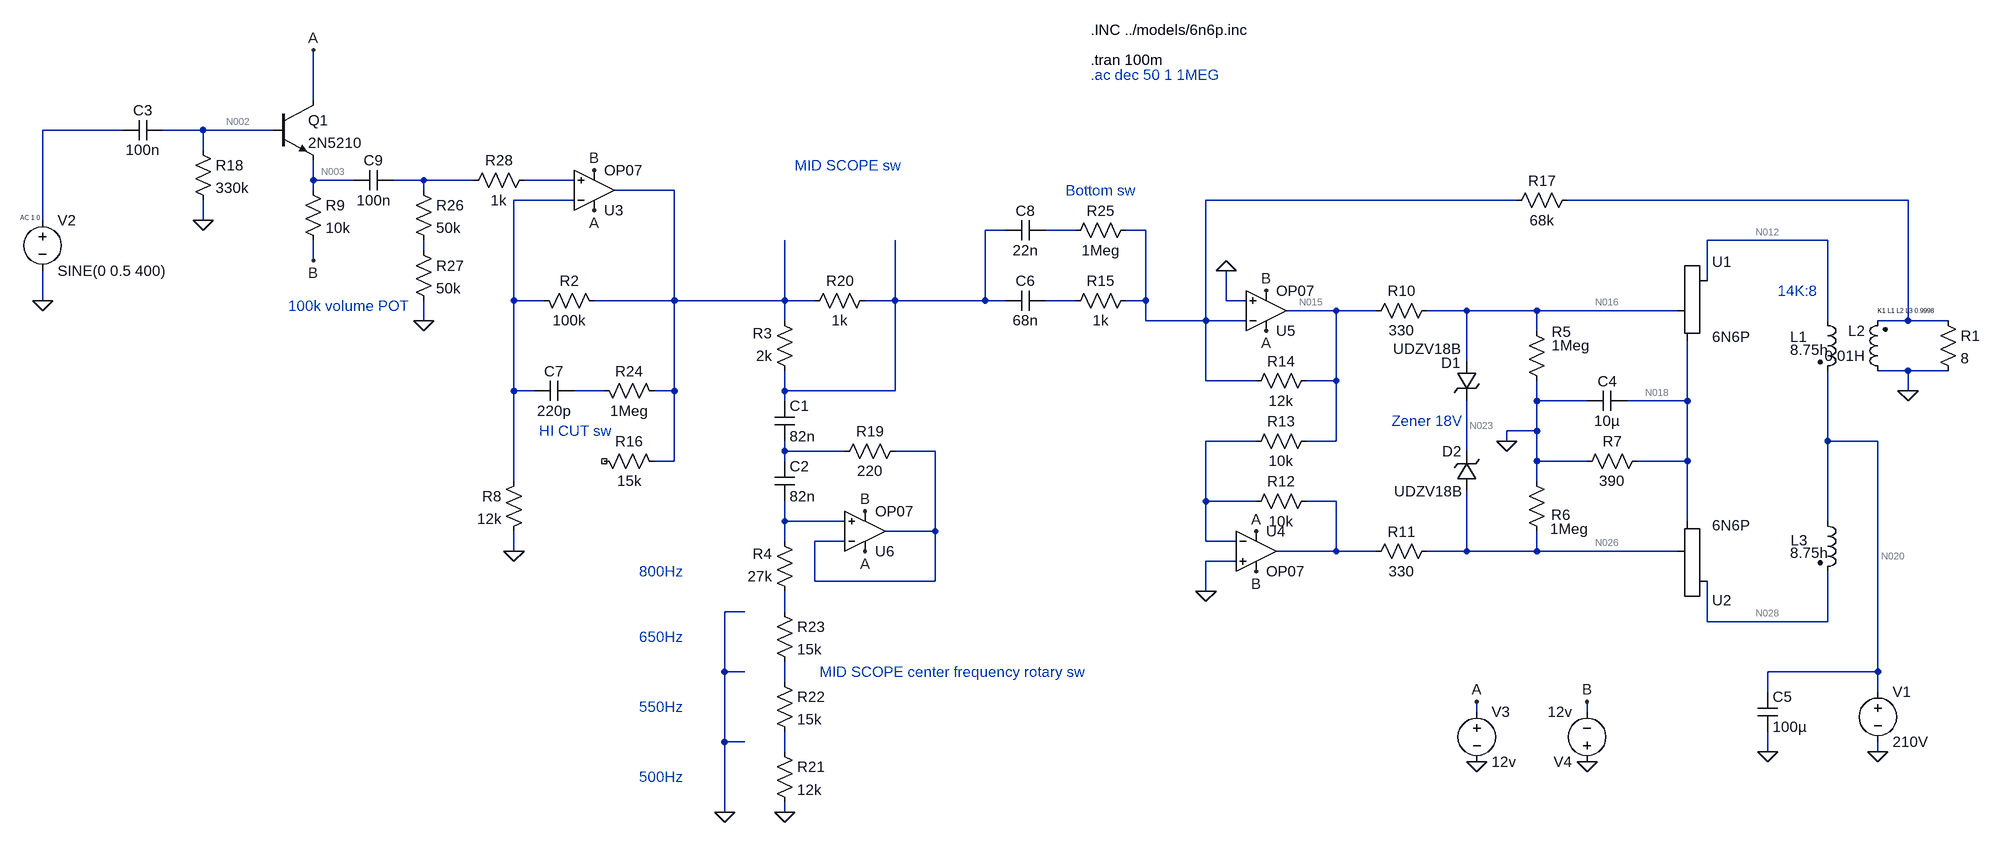
[diagram p0: schematic 6n6p.asc]
6n6p.asc, the LTspice schematic file:
Version 4
SHEET 1 1196 1956
WIRE -2048 96 -2048 16
WIRE -2352 144 -2480 144
WIRE -2224 144 -2288 144
WIRE -2112 144 -2224 144
WIRE -2224 176 -2224 144
WIRE -2048 224 -2048 192
WIRE -1984 224 -2048 224
WIRE -1872 224 -1920 224
WIRE -1792 224 -1872 224
WIRE -1632 224 -1712 224
WIRE -2048 240 -2048 224
WIRE -1872 240 -1872 224
WIRE -1472 240 -1568 240
WIRE -1632 256 -1728 256
WIRE -128 256 -624 256
WIRE 496 256 -48 256
WIRE -2480 288 -2480 144
WIRE -2224 288 -2224 256
WIRE -944 304 -976 304
WIRE -832 304 -880 304
WIRE -720 304 -752 304
WIRE 368 320 176 320
WIRE -1872 336 -1872 320
WIRE -2048 352 -2048 320
WIRE 176 384 176 320
WIRE -2480 416 -2480 368
WIRE -1728 416 -1728 256
WIRE -1680 416 -1728 416
WIRE -1472 416 -1472 240
WIRE -1472 416 -1600 416
WIRE -1296 416 -1296 320
WIRE -1296 416 -1472 416
WIRE -1248 416 -1296 416
WIRE -1120 416 -1120 320
WIRE -1120 416 -1168 416
WIRE -976 416 -976 304
WIRE -976 416 -1120 416
WIRE -944 416 -976 416
WIRE -832 416 -880 416
WIRE -720 416 -720 304
WIRE -720 416 -752 416
WIRE -592 416 -592 368
WIRE -560 416 -592 416
WIRE -416 432 -496 432
WIRE -352 432 -416 432
WIRE -208 432 -272 432
WIRE -96 432 -208 432
WIRE 128 432 -96 432
WIRE -1872 448 -1872 416
WIRE -1296 448 -1296 416
WIRE -720 448 -720 416
WIRE -624 448 -624 256
WIRE -624 448 -720 448
WIRE -560 448 -624 448
WIRE 368 448 368 320
WIRE 496 448 496 256
WIRE 496 448 448 448
WIRE 560 448 496 448
WIRE -96 464 -96 432
WIRE -208 512 -208 432
WIRE 496 528 448 528
WIRE 560 528 496 528
WIRE -624 544 -624 448
WIRE -544 544 -624 544
WIRE -416 544 -416 432
WIRE -416 544 -464 544
WIRE -1728 560 -1728 416
WIRE -1696 560 -1728 560
WIRE -1584 560 -1632 560
WIRE -1472 560 -1472 416
WIRE -1472 560 -1504 560
WIRE -1296 560 -1296 528
WIRE -1120 560 -1120 416
WIRE -1120 560 -1296 560
WIRE 496 560 496 528
WIRE -1296 576 -1296 560
WIRE -96 576 -96 544
WIRE -16 576 -96 576
WIRE 144 576 144 480
WIRE 144 576 48 576
WIRE -96 624 -96 576
WIRE -96 624 -144 624
WIRE -544 640 -624 640
WIRE -416 640 -416 544
WIRE -416 640 -464 640
WIRE -144 640 -144 624
WIRE 368 640 368 528
WIRE 448 640 368 640
WIRE -1296 656 -1296 640
WIRE -1200 656 -1296 656
WIRE -1056 656 -1120 656
WIRE -208 656 -208 576
WIRE -1472 672 -1472 560
WIRE -1472 672 -1504 672
WIRE -1296 672 -1296 656
WIRE -96 672 -96 624
WIRE -16 672 -96 672
WIRE 144 672 144 576
WIRE 144 672 64 672
WIRE -1728 704 -1728 560
WIRE -96 704 -96 672
WIRE -624 736 -624 640
WIRE -544 736 -624 736
WIRE -416 736 -464 736
WIRE -1296 768 -1296 736
WIRE -1200 768 -1296 768
WIRE 144 768 144 672
WIRE 368 768 368 640
WIRE -1056 784 -1056 656
WIRE -1056 784 -1136 784
WIRE -1296 800 -1296 768
WIRE -1200 800 -1248 800
WIRE -624 800 -624 736
WIRE -576 800 -624 800
WIRE -1728 816 -1728 784
WIRE -416 816 -416 736
WIRE -416 816 -512 816
WIRE -352 816 -416 816
WIRE -208 816 -208 720
WIRE -208 816 -272 816
WIRE -96 816 -96 784
WIRE -96 816 -208 816
WIRE 128 816 -96 816
WIRE -576 832 -624 832
WIRE -1248 864 -1248 800
WIRE -1056 864 -1056 784
WIRE -1056 864 -1248 864
WIRE -624 880 -624 832
WIRE -1360 912 -1392 912
WIRE -1296 912 -1296 880
WIRE 176 928 176 864
WIRE 368 928 368 848
WIRE 368 928 176 928
WIRE -1392 1008 -1392 912
WIRE -1360 1008 -1392 1008
WIRE 448 1008 448 640
WIRE 448 1008 272 1008
WIRE -1296 1024 -1296 992
WIRE 272 1040 272 1008
WIRE 448 1040 448 1008
WIRE -192 1072 -192 1056
WIRE -16 1072 -16 1056
WIRE -1392 1120 -1392 1008
WIRE -1360 1120 -1392 1120
WIRE -1296 1136 -1296 1104
WIRE 272 1136 272 1104
WIRE 448 1136 448 1120
WIRE -1392 1232 -1392 1120
WIRE -1296 1232 -1296 1216
FLAG 448 1136 0
FLAG -624 880 0
FLAG -2480 416 0
FLAG -192 1152 0
FLAG -192 1056 A
FLAG -16 1056 B
FLAG -528 464 A
FLAG -544 784 A
FLAG -528 400 B
FLAG -544 848 B
FLAG 272 1136 0
FLAG 496 560 0
FLAG -144 640 0
FLAG -1600 272 A
FLAG -1600 208 B
FLAG -1728 816 0
FLAG -16 1152 0
FLAG -1168 816 A
FLAG -1168 752 B
FLAG -1296 1232 0
FLAG -2224 288 0
FLAG -1392 1232 0
FLAG -2048 16 A
FLAG -2048 352 B
FLAG -1872 448 0
FLAG -592 368 0
DATAFLAG 112 576 "round($*10)/10"
DATAFLAG 144 672 "round(I(R7)*100000)/100000"
SYMBOL ind2 352 432 R0
WINDOW 0 -44 42 Left 2
WINDOW 3 -44 62 Left 2
SYMATTR InstName L1
SYMATTR Value 8.75h
SYMATTR Type ind
SYMATTR SpiceLine Rser=120 Cpar=120p
SYMBOL ind2 464 544 R180
WINDOW 0 36 80 Left 2
WINDOW 3 36 40 Left 2
SYMATTR InstName L2
SYMATTR Value 0.01H
SYMATTR Type ind
SYMATTR SpiceLine Rser=0.7
SYMBOL ind2 352 752 R0
WINDOW 0 -43 46 Left 2
WINDOW 3 -44 66 Left 2
SYMATTR InstName L3
SYMATTR Value 8.75h
SYMATTR Type ind
SYMATTR SpiceLine Rser=120 Cpar=120p
SYMBOL res 544 432 R0
SYMATTR InstName R1
SYMATTR Value 8
SYMBOL voltage 448 1024 R0
WINDOW 123 0 0 Left 0
WINDOW 39 0 0 Left 0
SYMATTR InstName V1
SYMATTR Value 210V
SYMBOL res -112 448 R0
WINDOW 0 40 18 Left 2
WINDOW 3 40 39 Left 2
SYMATTR InstName R5
SYMATTR Value 1Meg
SYMBOL res -112 688 R0
WINDOW 0 39 70 Left 2
WINDOW 3 37 92 Left 2
SYMATTR InstName R6
SYMATTR Value 1Meg
SYMBOL res 80 656 R90
WINDOW 0 0 56 VBottom 2
WINDOW 3 32 56 VTop 2
SYMATTR InstName R7
SYMATTR Value 390
SYMBOL cap 48 560 R90
WINDOW 0 0 32 VBottom 2
WINDOW 3 32 32 VTop 2
SYMATTR InstName C4
SYMATTR Value 10µ
SYMBOL res -448 720 R90
WINDOW 0 0 56 VBottom 2
WINDOW 3 32 56 VTop 2
SYMATTR InstName R12
SYMATTR Value 10k
SYMBOL res -560 656 R270
WINDOW 0 32 56 VTop 2
WINDOW 3 0 56 VBottom 2
SYMATTR InstName R13
SYMATTR Value 10k
SYMBOL res -448 528 R90
WINDOW 0 0 56 VBottom 2
WINDOW 3 32 56 VTop 2
SYMATTR InstName R14
SYMATTR Value 12k
SYMBOL res -736 400 R90
WINDOW 0 0 56 VBottom 2
WINDOW 3 32 56 VTop 2
SYMATTR InstName R15
SYMATTR Value 1k
SYMBOL voltage -2480 272 R0
WINDOW 123 -36 12 Left 0
WINDOW 39 0 0 Left 0
SYMATTR Value2 AC 1 0
SYMATTR InstName V2
SYMATTR Value SINE(0 0.5 400)
SYMBOL voltage -192 1056 R0
WINDOW 123 0 0 Left 0
WINDOW 39 0 0 Left 0
SYMATTR InstName V3
SYMATTR Value 12v
SYMBOL voltage -16 1168 R180
WINDOW 123 0 0 Left 0
WINDOW 39 0 0 Left 0
SYMATTR InstName V4
SYMATTR Value 12v
SYMBOL cap 256 1040 R0
SYMATTR InstName C5
SYMATTR Value 100µ
SYMBOL res -1712 688 M0
SYMATTR InstName R8
SYMATTR Value 12k
SYMBOL res -2240 160 R0
SYMATTR InstName R18
SYMATTR Value 330k
SYMBOL OpAmps\\OP07 -1600 304 M180
SYMATTR InstName U3
SYMBOL OpAmps\\OP07 -544 752 R0
SYMATTR InstName U4
SYMBOL OpAmps\\OP07 -528 496 M180
SYMATTR InstName U5
SYMBOL res -1280 544 R180
WINDOW 0 36 76 Left 2
WINDOW 3 36 40 Left 2
SYMATTR InstName R3
SYMATTR Value 2k
SYMBOL OpAmps\\OP07 -1168 848 M180
SYMATTR InstName U6
SYMBOL cap -1312 576 R0
SYMATTR InstName C1
SYMATTR Value 82n
SYMBOL cap -1312 672 R0
SYMATTR InstName C2
SYMATTR Value 82n
SYMBOL res -1280 896 R180
WINDOW 0 36 76 Left 2
WINDOW 3 36 40 Left 2
SYMATTR InstName R4
SYMATTR Value 27k
SYMBOL res -1104 640 R90
WINDOW 0 0 56 VBottom 2
WINDOW 3 32 56 VTop 2
SYMATTR InstName R19
SYMATTR Value 220
SYMBOL res -1152 400 R90
WINDOW 0 0 56 VBottom 2
WINDOW 3 32 56 VTop 2
SYMATTR InstName R20
SYMATTR Value 1k
SYMBOL res -1312 1120 R0
SYMATTR InstName R21
SYMATTR Value 12k
SYMBOL res -1312 1008 R0
SYMATTR InstName R22
SYMATTR Value 15k
SYMBOL res -1312 896 R0
SYMATTR InstName R23
SYMATTR Value 15k
SYMBOL Misc\\triode 176 432 R0
SYMATTR InstName U1
SYMATTR Value 6N6P
SYMATTR SpiceModel 6N6P
SYMBOL Misc\\triode 176 816 M180
SYMATTR InstName U2
SYMATTR Value 6N6P
SYMATTR SpiceModel 6N6P
SYMBOL cap -2288 128 R90
WINDOW 0 0 32 VBottom 2
WINDOW 3 32 32 VTop 2
SYMATTR InstName C3
SYMATTR Value 100n
SYMBOL cap -880 400 R90
WINDOW 0 0 32 VBottom 2
WINDOW 3 32 32 VTop 2
SYMATTR InstName C6
SYMATTR Value 68n
SYMBOL res -1584 432 M270
WINDOW 0 32 56 VTop 2
WINDOW 3 0 56 VBottom 2
SYMATTR InstName R2
SYMATTR Value 100k
SYMBOL cap -1632 576 M270
WINDOW 0 32 32 VTop 2
WINDOW 3 0 32 VBottom 2
SYMATTR InstName C7
SYMATTR Value 220p
SYMBOL res -1488 688 M270
WINDOW 0 32 56 VTop 2
WINDOW 3 0 56 VBottom 2
SYMATTR InstName R16
SYMATTR Value 15k
SYMBOL res -1488 576 M270
WINDOW 0 32 56 VTop 2
WINDOW 3 0 56 VBottom 2
SYMATTR InstName R24
SYMATTR Value 1Meg
SYMBOL res -256 416 R90
WINDOW 0 0 56 VBottom 2
WINDOW 3 32 56 VTop 2
SYMATTR InstName R10
SYMATTR Value 330
SYMBOL res -256 800 R90
WINDOW 0 0 56 VBottom 2
WINDOW 3 32 56 VTop 2
SYMATTR InstName R11
SYMATTR Value 330
SYMBOL zener -224 512 R0
WINDOW 0 -25 3 Left 2
WINDOW 3 -101 -19 Left 2
SYMATTR InstName D1
SYMATTR Value UDZV18B
SYMATTR Description Diode
SYMATTR Type diode
SYMBOL zener -192 720 R180
WINDOW 0 24 64 Left 2
WINDOW 3 24 0 Left 2
SYMATTR InstName D2
SYMATTR Value UDZV18B
SYMATTR Description Diode
SYMATTR Type diode
SYMBOL cap -880 288 R90
WINDOW 0 0 32 VBottom 2
WINDOW 3 32 32 VTop 2
SYMATTR InstName C8
SYMATTR Value 22n
SYMBOL res -736 288 R90
WINDOW 0 0 56 VBottom 2
WINDOW 3 32 56 VTop 2
SYMATTR InstName R25
SYMATTR Value 1Meg
SYMBOL res -32 240 R90
WINDOW 0 0 56 VBottom 2
WINDOW 3 32 56 VTop 2
SYMATTR InstName R17
SYMATTR Value 68k
SYMBOL npn -2112 96 R0
SYMATTR InstName Q1
SYMATTR Value 2N5210
SYMBOL res -2064 224 R0
SYMATTR InstName R9
SYMATTR Value 10k
SYMBOL cap -1920 208 R90
WINDOW 0 0 32 VBottom 2
WINDOW 3 32 32 VTop 2
SYMATTR InstName C9
SYMATTR Value 100n
SYMBOL res -1888 224 R0
SYMATTR InstName R26
SYMATTR Value 50k
SYMBOL res -1888 320 R0
SYMATTR InstName R27
SYMATTR Value 50k
SYMBOL res -1696 208 R90
WINDOW 0 0 56 VBottom 2
WINDOW 3 32 56 VTop 2
SYMATTR InstName R28
SYMATTR Value 1k
TEXT -808 -16 Left 2 !.INC ../models/6n6p.inc
TEXT 448 432 Left 0 !K1 L1 L2 L3 0.9998
TEXT -808 32 Left 2 !.tran 100m
TEXT -808 56 Left 2 ;.ac dec 50 1 1MEG
TEXT -1280 200 Left 2 ;MID SCOPE sw
TEXT -1688 624 Left 2 ;HI CUT sw
TEXT -1528 1176 Left 2 ;500Hz
TEXT -1528 1064 Left 2 ;550Hz
TEXT -1528 952 Left 2 ;650Hz
TEXT -1528 848 Left 2 ;800Hz
TEXT 288 400 Left 2 ;14K:8
TEXT -328 608 Left 2 ;Zener 18V
TEXT -848 240 Left 2 ;Bottom sw
TEXT -1240 1008 Left 2 ;MID SCOPE center frequency rotary sw
TEXT -2088 424 Left 2 ;100k volume POT

The netlist it stands for:
* 6n6p.asc
L1 N012 N020 8.75h Rser=120 Cpar=120p
L2 0 N009 0.01H Rser=0.7
L3 N020 N028 8.75h Rser=120 Cpar=120p
R1 N009 0 8
V1 N020 0 210V
R5 N016 0 1Meg
R6 0 N026 1Meg
R7 N018 0 390
C4 N018 0 10µ
R12 N024 N019 10k
R13 N019 N015 10k
R14 N015 N008 12k
R15 N008 N014 1k
V2 N001 0 SINE(0 0.5 400) AC 1 0
V3 A 0 12v
V4 0 B 12v
C5 N020 0 100µ
R8 N007 0 12k
R18 N002 0 330k
XU3 N005 N007 A B N006 LT1001  ; OP07, pins In+ In- V+ V- OUT
XU4 0 N019 A B N024 LT1001  ; OP07, pins In+ In- V+ V- OUT
XU5 0 N008 A B N015 LT1001  ; OP07, pins In+ In- V+ V- OUT
R3 N010 N006 2k
XU6 N025 N022 A B N022 LT1001  ; OP07, pins In+ In- V+ V- OUT
C1 N010 N021 82n
C2 N021 N025 82n
R4 N027 N025 27k
R19 N022 N021 220
R20 N010 N006 1k
R21 N030 0 12k
R22 N029 N030 15k
R23 N027 N029 15k
XU1 N012 N016 N018 6N6P 6N6P
XU2 N028 N026 N018 6N6P 6N6P
C3 N002 N001 100n
C6 N014 N010 68n
R2 N006 N007 100k
C7 N017 N007 220p
R16 N006 NC_01 15k
R24 N006 N017 1Meg
R10 N016 N015 330
R11 N026 N024 330
D1 N016 N023 UDZV18B
D2 N026 N023 UDZV18B
C8 N011 N010 22n
R25 N008 N011 1Meg
R17 N009 N008 68k
Q1 A N002 N003 0 2N5210
R9 N003 B 10k
C9 N004 N003 100n
R26 N004 N013 50k
R27 N013 0 50k
R28 N005 N004 1k
.model D D
.lib standard.dio
.model NPN NPN
.model PNP PNP
.lib standard.bjt
.INC ../models/6n6p.inc
K1 L1 L2 L3 0.9998
.tran 100m
* .ac dec 50 1 1MEG
* MID SCOPE sw
* HI CUT sw
* 500Hz
* 550Hz
* 650Hz
* 800Hz
* 14K:8
* Zener 18V
* Bottom sw
* MID SCOPE center frequency rotary sw
* 100k volume POT
.lib LTC.lib
.backanno
.end

* Results of the author's LTspice run, read from the files saved beside the schematic
* Operating Point, zero values left out:
*   V(n012) = 208.6 V
*   V(n020) = 210 V
*   V(n028) = 208.6 V
*   V(n016) = 332.9 nV
*   V(n026) = 332.9 nV
*   V(n018) = 9.122 V
*   V(a) = 12 V
*   V(b) = -12 V
*   V(n002) = -724.3 mV
*   V(n023) = 332.9 nV
*   V(n003) = -1.391 V
*   Ic(Q1) = 1.059 mA
*   Ib(Q1) = 2.195 µA
*   Ie(Q1) = -1.061 mA
*   I(L3) = 11.69 mA
*   I(L1) = -11.69 mA
*   I(R9) = 1.061 mA
*   I(R11) = 1.009 nA
*   I(R10) = 1.009 nA
*   I(R18) = -2.195 µA
*   I(R7) = 23.39 mA
*   I(V4) = -10.06 mA
*   I(V3) = -10.06 mA
*   I(V1) = -23.39 mA
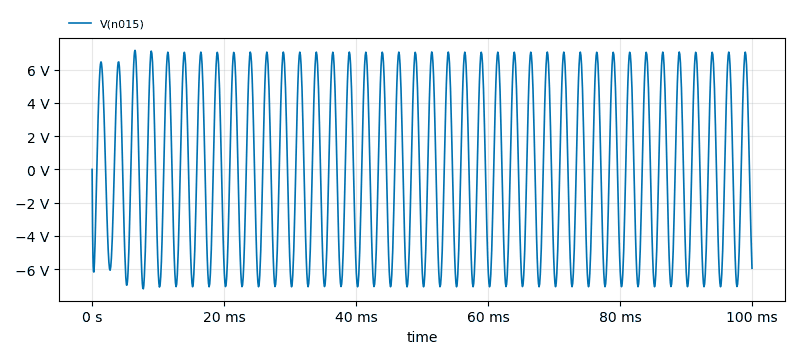
[diagram p1: Transient Analysis of 6n6p.asc, plotted from the saved traces]
* Transient Analysis, 1 run:
*   V(n015): min -7.188 V, max 7.167 V, average 15.36 mV, rms 4.97 V, last -5.954 V